# Altium schematic sheet 18B20.SchDoc
size A4
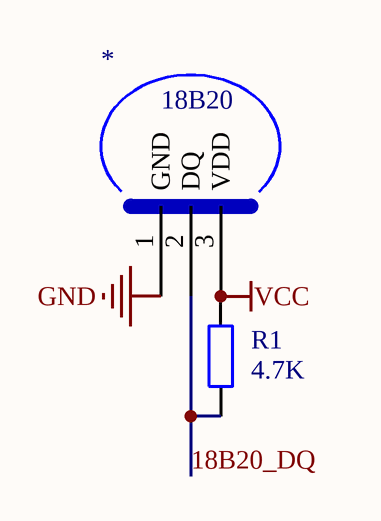
[diagram p0: 18B20.SchDoc]

## Parts
*  18B20  [HDR1X3]
R1  value 4.7K  [AXIAL-0.4]  (hidden comment: Res2)

## Nets
GND: *.1(GND)
VCC: *.3(VDD) R1.2
18B20_DQ: *.2(DQ) R1.1

## Library data of the parts
R1 = Res2: Resistor; Published: 8-Jun-2000; LatestRevisionDate: 17-Jul-2002; LatestRevisionNote: Re-released for DXP Platform.; PackageReference: AXIAL-0.4; Publisher: Altium Limited